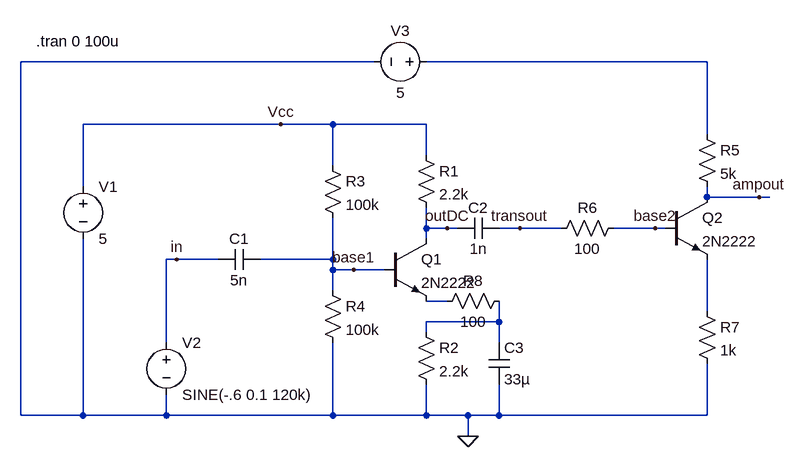
[diagram p0: schematic laserAmpAmp.asc]
laserAmpAmp.asc, the LTspice schematic file:
Version 4
SHEET 1 880 680
WIRE 160 0 -384 0
WIRE 672 0 240 0
WIRE 16 96 -288 96
WIRE 96 96 16 96
WIRE 240 96 96 96
WIRE 672 112 672 0
WIRE 240 144 240 96
WIRE 96 160 96 96
WIRE -288 192 -288 96
WIRE 672 208 672 192
WIRE 752 208 672 208
WIRE 768 208 752 208
WIRE 240 256 240 224
WIRE 272 256 240 256
WIRE 288 256 272 256
WIRE 384 256 352 256
WIRE 448 256 384 256
WIRE 592 256 528 256
WIRE 608 256 592 256
WIRE 240 272 240 256
WIRE -144 304 -160 304
WIRE -80 304 -144 304
WIRE 96 304 96 240
WIRE 96 304 -16 304
WIRE 96 320 96 304
WIRE 128 320 96 320
WIRE 176 320 128 320
WIRE 96 352 96 320
WIRE 272 368 240 368
WIRE 672 384 672 304
WIRE 352 400 352 368
WIRE 352 400 240 400
WIRE 240 416 240 400
WIRE -160 432 -160 304
WIRE 352 432 352 400
WIRE -384 544 -384 0
WIRE -288 544 -288 272
WIRE -288 544 -384 544
WIRE -160 544 -160 512
WIRE -160 544 -288 544
WIRE 96 544 96 432
WIRE 96 544 -160 544
WIRE 240 544 240 496
WIRE 240 544 96 544
WIRE 304 544 240 544
WIRE 352 544 352 496
WIRE 352 544 304 544
WIRE 672 544 672 464
WIRE 672 544 352 544
WIRE 304 576 304 544
FLAG 304 576 0
FLAG -144 304 in
FLAG 272 256 outDC
FLAG 384 256 transout
FLAG 16 96 Vcc
FLAG 752 208 ampout
FLAG 128 320 base1
FLAG 592 256 base2
SYMBOL npn 176 272 R0
SYMATTR InstName Q1
SYMATTR Value 2N2222
SYMBOL res 224 128 R0
SYMATTR InstName R1
SYMATTR Value 2.2k
SYMBOL res 224 400 R0
SYMATTR InstName R2
SYMATTR Value 2.2k
SYMBOL res 80 144 R0
SYMATTR InstName R3
SYMATTR Value 100k
SYMBOL res 80 336 R0
SYMATTR InstName R4
SYMATTR Value 100k
SYMBOL voltage -288 176 R0
SYMATTR InstName V1
SYMATTR Value 5
SYMBOL voltage -160 416 R0
SYMATTR Value2 AC .
SYMATTR InstName V2
SYMATTR Value SINE(-.6 0.1 120k)
SYMBOL cap -16 320 M270
WINDOW 0 32 32 VTop 2
WINDOW 3 0 32 VBottom 2
SYMATTR InstName C1
SYMATTR Value 5n
SYMBOL cap 352 272 M270
WINDOW 0 32 32 VTop 2
WINDOW 3 0 32 VBottom 2
SYMATTR InstName C2
SYMATTR Value 1n
SYMBOL cap 336 432 R0
SYMATTR InstName C3
SYMATTR Value 33µ
SYMBOL res 544 240 R90
WINDOW 0 0 56 VBottom 2
WINDOW 3 32 56 VTop 2
SYMATTR InstName R6
SYMATTR Value 100
SYMBOL npn 608 208 R0
SYMATTR InstName Q2
SYMATTR Value 2N2222
SYMBOL res 656 96 R0
SYMATTR InstName R5
SYMATTR Value 5k
SYMBOL voltage 256 0 R90
WINDOW 0 -32 56 VBottom 2
WINDOW 3 32 56 VTop 2
SYMATTR InstName V3
SYMATTR Value 5
SYMBOL res 656 368 R0
SYMATTR InstName R7
SYMATTR Value 1k
SYMBOL res 368 352 R90
WINDOW 0 0 56 VBottom 2
WINDOW 3 32 56 VTop 2
SYMATTR InstName R8
SYMATTR Value 100
TEXT -360 -32 Left 2 !.tran 0 100u

The netlist it stands for:
* laserAmpAmp.asc
Q1 outDC base1 N002 0 2N2222
R1 Vcc outDC 2.2k
R2 N004 0 2.2k
R3 Vcc base1 100k
R4 base1 0 100k
V1 Vcc 0 5
V2 in 0 SINE(-.6 0.1 120k) AC .
C1 base1 in 5n
C2 transout outDC 1n
C3 N004 0 33µ
R6 base2 transout 100
Q2 ampout base2 N003 0 2N2222
R5 N001 ampout 5k
V3 N001 0 5
R7 N003 0 1k
R8 N004 N002 100
.model NPN NPN
.model PNP PNP
.lib standard.bjt
.tran 0 100u
.backanno
.end